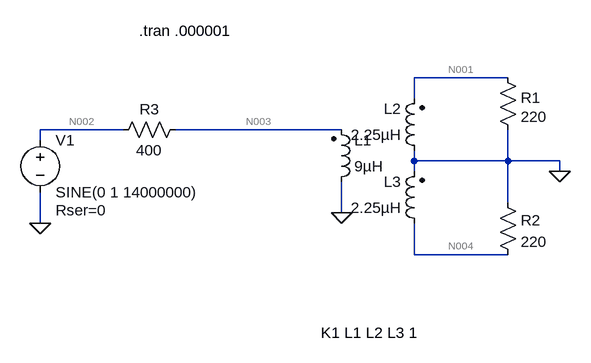
[diagram p0: schematic Splitter.asc]
Splitter.asc, the LTspice schematic file:
Version 4
SHEET 1 880 680
WIRE 400 48 256 48
WIRE 256 80 256 48
WIRE -192 128 -320 128
WIRE 144 128 -112 128
WIRE -320 144 -320 128
WIRE 256 176 256 160
WIRE 400 176 400 128
WIRE 400 176 256 176
WIRE 480 176 400 176
WIRE 256 192 256 176
WIRE 480 192 480 176
WIRE 400 240 400 176
WIRE 144 256 144 208
WIRE -320 272 -320 224
WIRE 256 320 256 272
WIRE 400 320 256 320
FLAG -320 272 0
FLAG 144 256 0
FLAG 480 192 0
SYMBOL ind2 128 224 M180
WINDOW 0 36 80 Left 2
WINDOW 3 36 40 Left 2
SYMATTR InstName L1
SYMATTR Value 9µH
SYMATTR Type ind
SYMBOL ind2 272 176 R180
WINDOW 0 36 80 Left 2
WINDOW 3 36 40 Left 2
SYMATTR InstName L2
SYMATTR Value 2.25µH
SYMATTR Type ind
SYMBOL ind2 272 288 R180
WINDOW 0 36 80 Left 2
WINDOW 3 36 40 Left 2
SYMATTR InstName L3
SYMATTR Value 2.25µH
SYMATTR Type ind
SYMBOL res 384 32 R0
WINDOW 0 36 47 Left 2
SYMATTR InstName R1
SYMATTR Value 220
SYMBOL res 384 224 R0
WINDOW 0 36 43 Left 2
SYMATTR InstName R2
SYMATTR Value 220
SYMBOL voltage -320 128 R0
WINDOW 123 0 0 Left 0
WINDOW 39 24 124 Left 2
SYMATTR SpiceLine Rser=0
SYMATTR InstName V1
SYMATTR Value SINE(0 1 14000000)
SYMBOL res -96 112 R90
WINDOW 0 0 56 VBottom 2
WINDOW 3 32 56 VTop 2
SYMATTR InstName R3
SYMATTR Value 400
TEXT 112 440 Left 2 !K1 L1 L2 L3 1
TEXT -168 -24 Left 2 !.tran .000001

The netlist it stands for:
* Splitter.asc
L1 0 N003 9µH
L2 0 N001 2.25µH
L3 N004 0 2.25µH
R1 N001 0 220
R2 0 N004 220
V1 N002 0 SINE(0 1 14000000) Rser=0
R3 N003 N002 400
K1 L1 L2 L3 1
.tran .000001
.backanno
.end

* Results of the author's LTspice run, read from the files saved beside the schematic
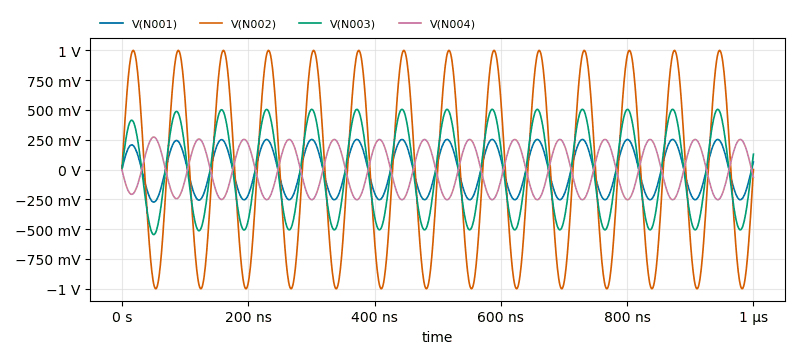
[diagram p1: Transient Analysis of Splitter.asc, plotted from the saved traces]
* Transient Analysis, 1 run:
*   V(N001): min -272.6 mV, max 252.7 mV, average -2.781 mV, rms 177.9 mV, last 64.73 mV
*   V(N002): min -1 V, max 1 V, average 0 V, rms 707.1 mV, last 0 V
*   V(N003): min -545.2 mV, max 505.4 mV, average -5.562 mV, rms 355.9 mV, last 129.5 mV
*   V(N004): min -252.7 mV, max 272.6 mV, average 2.781 mV, rms 177.9 mV, last -64.73 mV